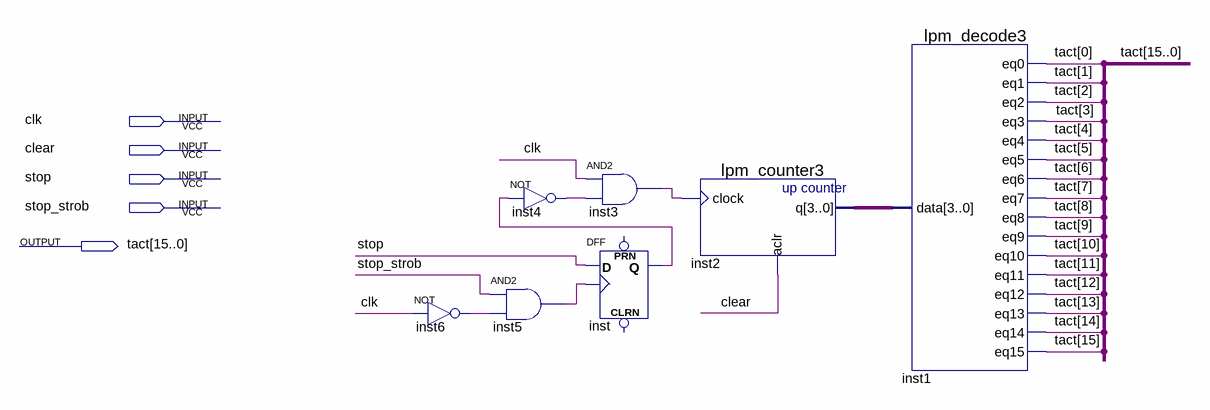
[diagram p0: schematic sheet]
// Quartus schematic takt.bdf as structural Verilog: 7 symbols, 5 pins
module takt (
  input  clk,
  input  clear,
  input  stop,
  input  stop_strob,
  output [15:0] tact
);

  wire inst3_out, inst4_out, inst5_out, inst6_out, inst_q;
  wire [3:0] inst2_q;

  not inst6 (inst6_out, clk);
  not inst4 (inst4_out, inst_q);
  and inst5 (inst5_out, stop_strob, inst6_out);
  and inst3 (inst3_out, clk, inst4_out);
  DFF inst (.CLK(inst5_out), .D(stop), .Q(inst_q));  // open: CLRN, PRN
  lpm_counter3 inst2 (.clock(inst3_out), .aclr(clear), .q(inst2_q));
  lpm_decode3 inst1 (
    .data(inst2_q), .eq0(tact[0]), .eq1(tact[1]), .eq2(tact[2]), .eq3(tact[3]), .eq4(tact[4]), .eq5(tact[5]),
    .eq6(tact[6]), .eq7(tact[7]), .eq8(tact[8]), .eq9(tact[9]), .eq10(tact[10]), .eq11(tact[11]),
    .eq12(tact[12]), .eq13(tact[13]), .eq14(tact[14]), .eq15(tact[15]));
endmodule
